# Altium project Nixie_thermometer.PrjPcb
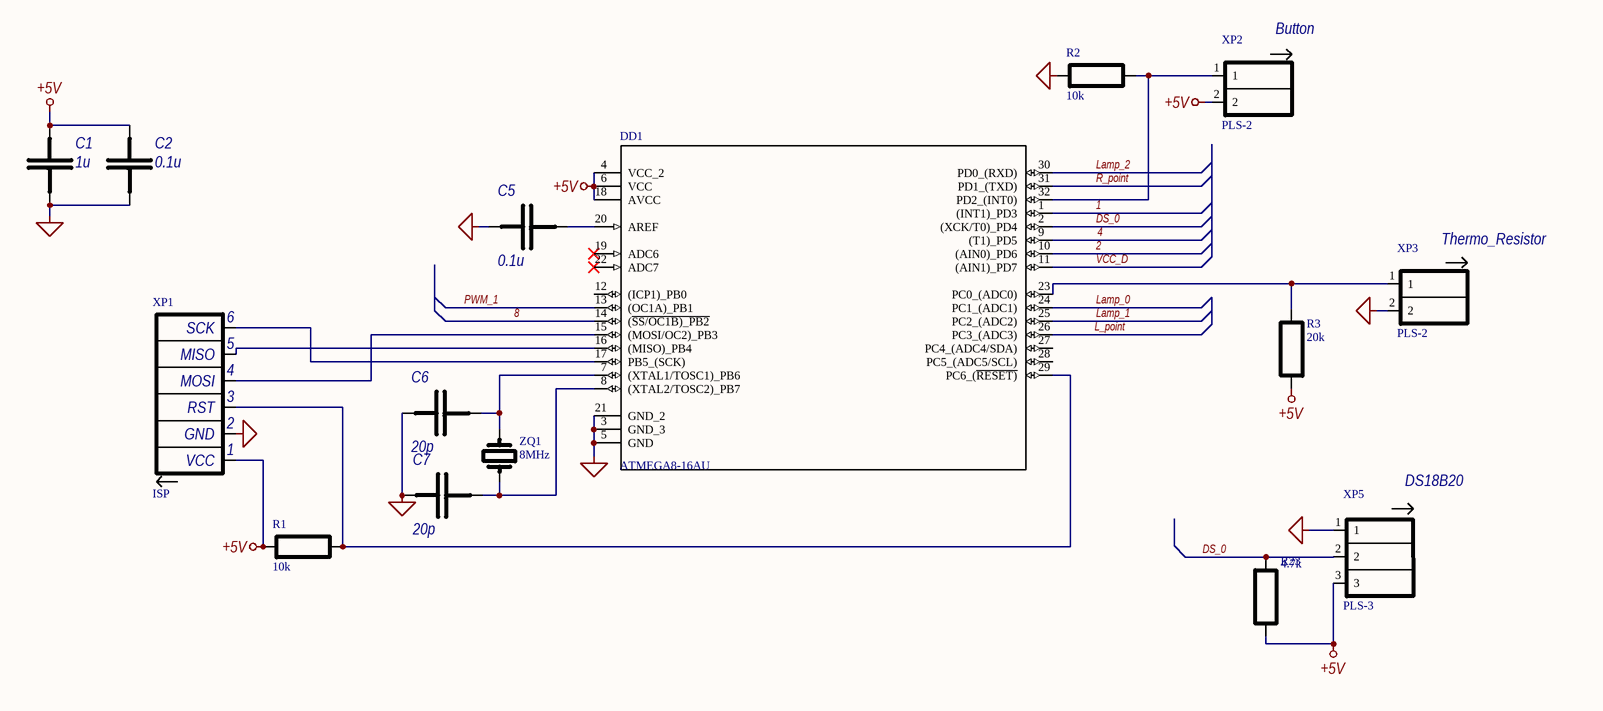
[diagram p0: mcu.SchDoc]
4 sheets, 57 parts. Net scope: global (net labels, ports and power ports of the same name join across sheets).
Board file: PCB.PcbDoc
Sheets:
  mcu.SchDoc
  Lamps.SchDoc
  Power.SchDoc
  Lamp_C_Unit.SchDoc

## Sheet mcu.SchDoc: {Наименование}
size 420 x 297 mm; ApprovedBy: {Утвердил}; CheckedBy: {Проверил}; DrawnBy: {Разработал}; Engineer: {Инженер}; DocumentNumber: {Обозначение}; SheetNumber: {}; SheetTotal: {}; Scale: {Масш.}; Title1str: {Наименование}; PageSetup: Record=PageOptions|CenterHorizontal=False|CenterVertical=False|PrintScale=0.95|XCorrection=0.00|YCorrection=0.00|PrintKind=1|BorderSize=5000000|LeftOffset=0|BottomOffset=0|Orientation=1|PaperLength=1000|PaperWidth=1000|Scale=100|PaperSource=15|PrintQuality=600|MediaType=1|DitherType=10|PaperKind=A4|PrintScaleMode=1; Title2str: {Наименование}; ProcessInspection: {Т.контр.}; Mass: {Масса}; NormInspection: {Н.контр.}; EngineerName: {Инженер}; Letter1Column: {}; Letter2Column: {}; Letter3Column: {}; DocumentType: {Документ}; DocumentType1str: {Документ}; DocumentType2str: {Документ}; ImagePath: {Перв. применение}; Rule: PcbType=ProtelPcb

### Parts
C1  1u  [CR2012-0805]
C2  0.1u  [CR2012-0805]
C5  0.1u  [CR2012-0805]
C6  20p  [CR2012-0805]
C7  20p  [CR2012-0805]
DD1  ATMEGA8-16AU  [*QFP80P900X900X120-32N]
R1  10k  [CR2012-0805]
R2  10k  [CR2012-0805]
R3  20k  [CR2012-0805]
R23  4.7k  [CR2012-0805]
XP1  ISP  [PLS-6]
XP2  PLS-2  [PLS-2]
XP3  PLS-2  [PLS-2]
XP5  PLS-3  [PLS-3]
ZQ1  8MHz  [CRYSTAL]

### Nets
+5V: C1.1 C2.1 DD1.4(VCC_2) DD1.6(VCC) DD1.18(AVCC) R1.1 R3.1 R23.2 XP1.1(VCC) XP2.2 XP5.3
SGND: C1.2 C2.2 C5.1 C6.1 C7.1 DD1.3(GND_3) DD1.5(GND) DD1.21(GND_2) R2.1 XP1.2(GND) XP3.2 XP5.1
1: DD1.1((INT1)_PD3)
2: DD1.10((AIN0)_PD6)
4: DD1.9((T1)_PD5)
8: DD1.14((~{SS/OC1B)_PB2})
DS_0: DD1.2((XCK/T0)_PD4) R23.1 XP5.2
L_point: DD1.26(PC3_(ADC3))
Lamp_0: DD1.24(PC1_(ADC1))
Lamp_1: DD1.25(PC2_(ADC2))
Lamp_2: DD1.30(PD0_(RXD))
PWM_1: DD1.13((OC1A)_PB1)
R_point: DD1.31(PD1_(TXD))
VCC_D: DD1.11((AIN1)_PD7)
NetC5_2: C5.2 DD1.20(AREF)
NetC6_2: C6.2 DD1.7((XTAL1/TOSC1)_PB6) ZQ1.1
NetC7_2: C7.2 DD1.8((XTAL2/TOSC2)_PB7) ZQ1.2
NetDD1_15: DD1.15((MOSI/OC2)_PB3) XP1.4(MOSI)
NetDD1_16: DD1.16((MISO)_PB4) XP1.5(MISO)
NetDD1_17: DD1.17(PB5_(SCK)) XP1.6(SCK)
NetDD1_23: DD1.23(PC0_(ADC0)) R3.2 XP3.1
NetDD1_29: DD1.29(PC6_(~{RESET)}) R1.2 XP1.3(RST)
NetDD1_32: DD1.32(PD2_(INT0)) R2.2 XP2.1

Not connected (* = marked no-connect by the designer): DD1 12((ICP1)_PB0) 19(ADC6)* 22(ADC7)* 27(PC4_(ADC4/SDA)) 28(PC5_(ADC5/SCL))

### Notes on the sheet
- Button
- (near XP3) Thermo_Resistor
- DS18B20
- Перв. примен.
- Справ. №
- Подп. и дата
- Инв. № дубл.
- Взам. инв. №
- Изм.
- Лист
- № докум.
- Подп.
- Дата
- Лит.
- Масса
- Масштаб
- Т.контр.
- Пров.
- Разраб.
- Листов
- Инв. № подл.
- Н.контр.
- Утв.
- Копировал
- Формат А3

### Library data of the parts
C1 = C0805-1u-X7R
C2 C5 = C0805-0.1u-X7R
C6 C7 = C0805-20p-NPO
DD1 = ATMEGA8-16AU: / AVR AVRВ® ATmega Microcontroller IC 8-Bit 16MHz 8KB _4K x 16_ FLASH 32-TQFP _7x7_ /; MF: Microchip Technology; SnapEDA_Link: https://www.snapeda.com/parts/ATMEGA8-16AU/Microchip/view-part/4246640/?ref=snap; Price: None; MP: ATMEGA8-16AU; Availability: Unavailable; Package: TQFP-32 Microchip Technology; Value: *
R1 R2 = R0805-10k-5%
R3 = R0805-20k-5%
R23 = R0805-4k7-5%
ZQ1 = Crystal_8MHz

## Sheet Lamps.SchDoc: {Наименование}
size 420 x 297 mm; ApprovedBy: {Утвердил}; CheckedBy: {Проверил}; DrawnBy: {Разработал}; Engineer: {Инженер}; DocumentNumber: {Обозначение}; SheetNumber: {}; SheetTotal: {}; Scale: {Масш.}; Title1str: {Наименование}; PageSetup: Record=PageOptions|CenterHorizontal=False|CenterVertical=False|PrintScale=0.95|XCorrection=0.00|YCorrection=0.00|PrintKind=1|BorderSize=5000000|LeftOffset=0|BottomOffset=0|Orientation=1|PaperLength=1000|PaperWidth=1000|Scale=100|PaperSource=15|PrintQuality=600|MediaType=1|DitherType=10|PaperKind=A4|PrintScaleMode=1; Title2str: {Наименование}; ProcessInspection: {Т.контр.}; Mass: {Масса}; NormInspection: {Н.контр.}; EngineerName: {Инженер}; Letter1Column: {}; Letter2Column: {}; Letter3Column: {}; DocumentType: {Документ}; DocumentType1str: {Документ}; DocumentType2str: {Документ}; ImagePath: {Перв. применение}; Rule: PcbType=ProtelPcb
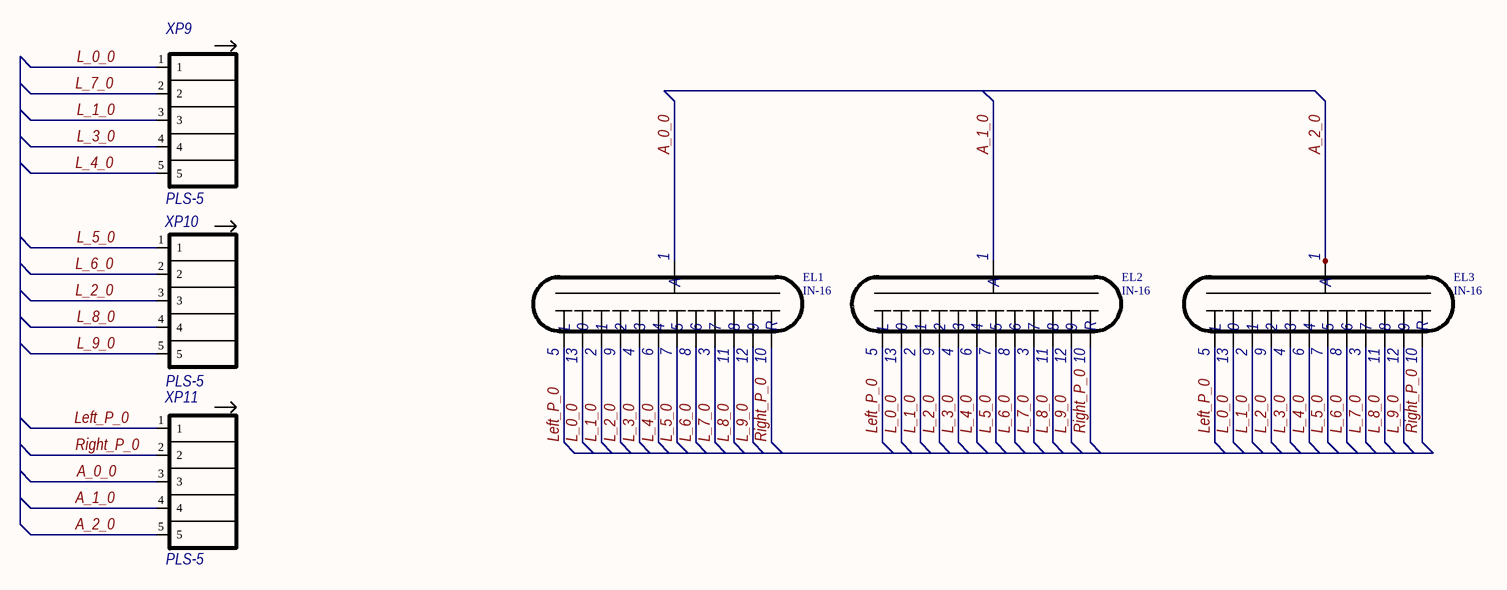
[diagram p1: Lamps.SchDoc]

### Parts
EL1  IN-16  [IN-16]
EL2  IN-16  [IN-16]
EL3  IN-16  [IN-16]
XP9  PLS-5  [PLS-5]
XP10  PLS-5  [PLS-5]
XP11  PLS-5  [PLS-5]

### Nets
A_0_0: EL1.1(A) XP11.3
A_1_0: EL2.1(A) XP11.4
A_2_0: EL3.1(A) XP11.5
L_0_0: EL1.13(0) EL2.13(0) EL3.13(0) XP9.1
L_1_0: EL1.2(1) EL2.2(1) EL3.2(1) XP9.3
L_2_0: EL1.9(2) EL2.9(2) EL3.9(2) XP10.3
L_3_0: EL1.4(3) EL2.4(3) EL3.4(3) XP9.4
L_4_0: EL1.6(4) EL2.6(4) EL3.6(4) XP9.5
L_5_0: EL1.7(5) EL2.7(5) EL3.7(5) XP10.1
L_6_0: EL1.8(6) EL2.8(6) EL3.8(6) XP10.2
L_7_0: EL1.3(7) EL2.3(7) EL3.3(7) XP9.2
L_8_0: EL1.11(8) EL2.11(8) EL3.11(8) XP10.4
L_9_0: EL1.12(9) EL2.12(9) EL3.12(9) XP10.5
Left_P_0: EL1.5(L) EL2.5(L) EL3.5(L) XP11.1
Right_P_0: EL1.10(R) EL2.10(R) EL3.10(R) XP11.2

### Notes on the sheet
- Перв. примен.
- Справ. №
- Подп. и дата
- Инв. № дубл.
- Взам. инв. №
- Изм.
- Лист
- № докум.
- Подп.
- Дата
- Лит.
- Масса
- Масштаб
- Т.контр.
- Пров.
- Разраб.
- Листов
- Инв. № подл.
- Н.контр.
- Утв.
- Копировал
- Формат А3

## Sheet Power.SchDoc: {Наименование}
size 420 x 297 mm; ApprovedBy: {Утвердил}; CheckedBy: {Проверил}; DrawnBy: {Разработал}; Engineer: {Инженер}; DocumentNumber: {Обозначение}; SheetNumber: {}; SheetTotal: {}; Scale: {Масш.}; Title1str: {Наименование}; PageSetup: Record=PageOptions|CenterHorizontal=False|CenterVertical=False|PrintScale=0.95|XCorrection=0.00|YCorrection=0.00|PrintKind=1|BorderSize=5000000|LeftOffset=0|BottomOffset=0|Orientation=1|PaperLength=1000|PaperWidth=1000|Scale=100|PaperSource=15|PrintQuality=600|MediaType=1|DitherType=10|PaperKind=A4|PrintScaleMode=1; Title2str: {Наименование}; ProcessInspection: {Т.контр.}; Mass: {Масса}; NormInspection: {Н.контр.}; EngineerName: {Инженер}; Letter1Column: {}; Letter2Column: {}; Letter3Column: {}; DocumentType: {Документ}; DocumentType1str: {Документ}; DocumentType2str: {Документ}; ImagePath: {Перв. применение}; Rule: PcbType=ProtelPcb
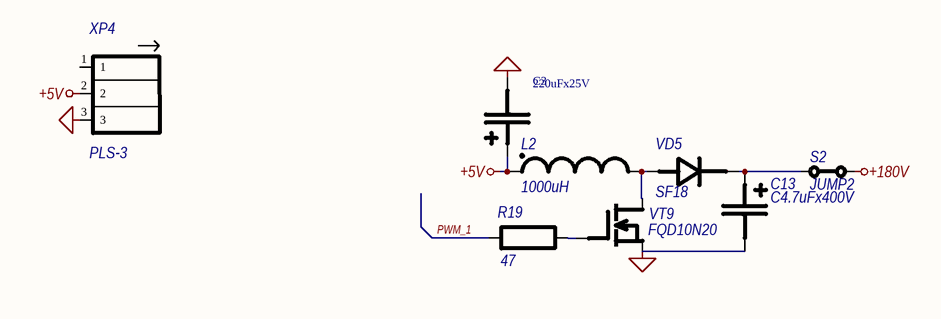
[diagram p2: Power.SchDoc]

### Parts
C3  220uFx25V  [C8x11.5]
C13  C4.7uFx400V  [C10x16]
L2  1000uH  [CHOKE1]
R19  47  [CR2012-0805]
S2  JUMP2  [JUMP]
VD5  SF18  [DO-41]
VT9  FQD10N20  [TO-252]
XP4  PLS-3  [PLS-3]

### Nets
+5V: C3.1 L2.1 XP4.2
+180V: S2.1
SGND: C3.2 C13.2 VT9.2(S) XP4.3
PWM_1: R19.1
NetC13_1: C13.1 S2.2 VD5.2(K)
NetL2_2: L2.2 VD5.1(A) VT9.3(D)
NetR19_2: R19.2 VT9.1(G)

Not connected (* = marked no-connect by the designer): XP4 1

### Notes on the sheet
- Перв. примен.
- Справ. №
- Подп. и дата
- Инв. № дубл.
- Взам. инв. №
- Изм.
- Лист
- № докум.
- Подп.
- Дата
- Лит.
- Масса
- Масштаб
- Т.контр.
- Пров.
- Разраб.
- Листов
- Инв. № подл.
- Н.контр.
- Утв.
- Копировал
- Формат А3

### Library data of the parts
C3 = C220uFx25V YAGEO SY: SY025M0220A3F-0811
L2 = CHOKE_1
R19 = R0805-47R-5%

## Sheet Lamp_C_Unit.SchDoc: {Наименование}
size 420 x 297 mm; ApprovedBy: {Утвердил}; CheckedBy: {Проверил}; DrawnBy: {Разработал}; Engineer: {Инженер}; DocumentNumber: {Обозначение}; SheetNumber: {}; SheetTotal: {}; Scale: {Масш.}; Title1str: {Наименование}; PageSetup: Record=PageOptions|CenterHorizontal=False|CenterVertical=False|PrintScale=0.95|XCorrection=0.00|YCorrection=0.00|PrintKind=1|BorderSize=5000000|LeftOffset=0|BottomOffset=0|Orientation=1|PaperLength=1000|PaperWidth=1000|Scale=100|PaperSource=15|PrintQuality=600|MediaType=1|DitherType=10|PaperKind=A4|PrintScaleMode=1; Title2str: {Наименование}; ProcessInspection: {Т.контр.}; Mass: {Масса}; NormInspection: {Н.контр.}; EngineerName: {Инженер}; Letter1Column: {}; Letter2Column: {}; Letter3Column: {}; DocumentType: {Документ}; DocumentType1str: {Документ}; DocumentType2str: {Документ}; ImagePath: {Перв. применение}; Rule: PcbType=ProtelPcb
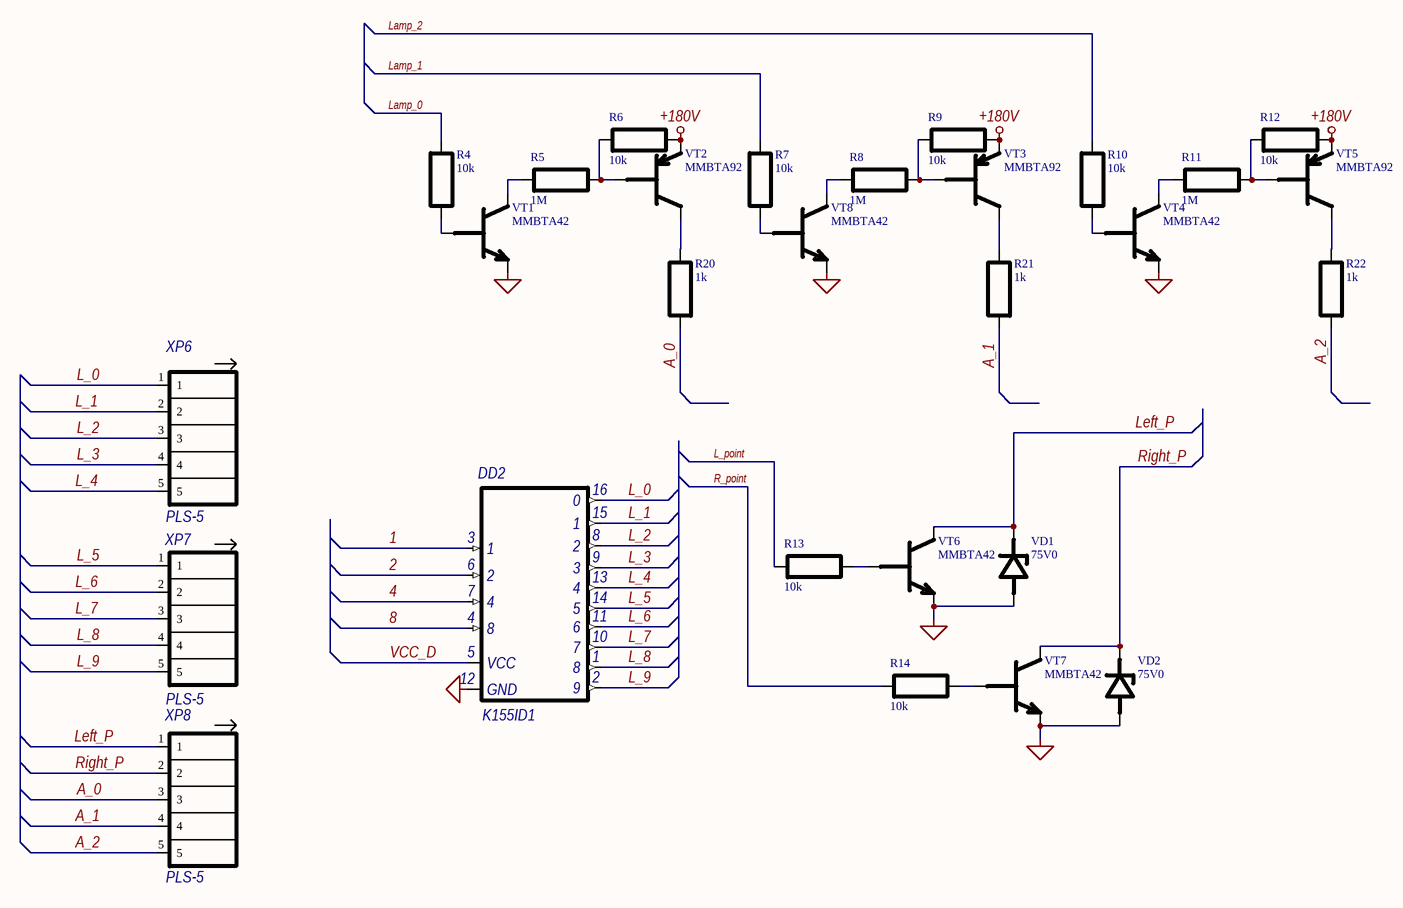
[diagram p3: Lamp_C_Unit.SchDoc]

### Parts
DD2  K155ID1  [DIP16]
R4  10k  [CR2012-0805]
R5  1M  [CR2012-0805]
R6  10k  [CR2012-0805]
R7  10k  [CR2012-0805]
R8  1M  [CR2012-0805]
R9  10k  [CR2012-0805]
R10  10k  [CR2012-0805]
R11  1M  [CR2012-0805]
R12  10k  [CR2012-0805]
R13  10k  [CR2012-0805]
R14  10k  [CR2012-0805]
R20  1k  [CR2012-0805]
R21  1k  [CR2012-0805]
R22  1k  [CR2012-0805]
VD1  75V0  [SOD-80]
VD2  75V0  [SOD-80]
VT1  MMBTA42  [SOT-23]
VT2  MMBTA92  [SOT-23]
VT3  MMBTA92  [SOT-23]
VT4  MMBTA42  [SOT-23]
VT5  MMBTA92  [SOT-23]
VT6  MMBTA42  [SOT-23]
VT7  MMBTA42  [SOT-23]
VT8  MMBTA42  [SOT-23]
XP6  PLS-5  [PLS-5]
XP7  PLS-5  [PLS-5]
XP8  PLS-5  [PLS-5]

### Nets
+180V: R6.2 R9.2 R12.2 VT2.2(E) VT3.2(E) VT5.2(E)
SGND: DD2.12(GND) VD1.1(A) VD2.1(A) VT1.2(E) VT4.2(E) VT6.2(E) VT7.2(E) VT8.2(E)
1: DD2.3(1)
2: DD2.6(2)
4: DD2.7(4)
8: DD2.4(8)
A_0: R20.1 XP8.3
A_1: R21.1 XP8.4
A_2: R22.1 XP8.5
L_0: DD2.16(0) XP6.1
L_1: DD2.15(1) XP6.2
L_2: DD2.8(2) XP6.3
L_3: DD2.9(3) XP6.4
L_4: DD2.13(4) XP6.5
L_5: DD2.14(5) XP7.1
L_6: DD2.11(6) XP7.2
L_7: DD2.10(7) XP7.3
L_8: DD2.1(8) XP7.4
L_9: DD2.2(9) XP7.5
L_point: R13.1
Lamp_0: R4.1
Lamp_1: R7.1
Lamp_2: R10.1
Left_P: VD1.2(K) VT6.3(C) XP8.1
R_point: R14.1
Right_P: VD2.2(K) VT7.3(C) XP8.2
VCC_D: DD2.5(VCC)
NetR4_2: R4.2 VT1.1(B)
NetR5_1: R5.1 VT1.3(C)
NetR5_2: R5.2 R6.1 VT2.1(B)
NetR7_2: R7.2 VT8.1(B)
NetR8_1: R8.1 VT8.3(C)
NetR8_2: R8.2 R9.1 VT3.1(B)
NetR10_2: R10.2 VT4.1(B)
NetR11_1: R11.1 VT4.3(C)
NetR11_2: R11.2 R12.1 VT5.1(B)
NetR13_2: R13.2 VT6.1(B)
NetR14_2: R14.2 VT7.1(B)
NetR20_2: R20.2 VT2.3(C)
NetR21_2: R21.2 VT3.3(C)
NetR22_2: R22.2 VT5.3(C)

### Notes on the sheet
- Перв. примен.
- Справ. №
- Подп. и дата
- Инв. № дубл.
- Взам. инв. №
- Изм.
- Лист
- № докум.
- Подп.
- Дата
- Лит.
- Масса
- Масштаб
- Т.контр.
- Пров.
- Разраб.
- Листов
- Инв. № подл.
- Н.контр.
- Утв.
- Копировал
- Формат А3

### Library data of the parts
R4-R14 = R0805-10k-5%
R20-R22 = R0805-1k-5%
VD1 VD2 = BZV55-C20V0

## Nets that join several sheets
+5V: mcu (11 pins), Power (C3.1 L2.1 XP4.2)
+180V: Power (S2.1), Lamp_C_Unit (6 pins)
SGND: mcu (12 pins), Power (C3.2 C13.2 VT9.2 XP4.3), Lamp_C_Unit (8 pins)
1: mcu (DD1.1), Lamp_C_Unit (DD2.3)
2: mcu (DD1.10), Lamp_C_Unit (DD2.6)
4: mcu (DD1.9), Lamp_C_Unit (DD2.7)
8: mcu (DD1.14), Lamp_C_Unit (DD2.4)
L_point: mcu (DD1.26), Lamp_C_Unit (R13.1)
Lamp_0: mcu (DD1.24), Lamp_C_Unit (R4.1)
Lamp_1: mcu (DD1.25), Lamp_C_Unit (R7.1)
Lamp_2: mcu (DD1.30), Lamp_C_Unit (R10.1)
PWM_1: mcu (DD1.13), Power (R19.1)
R_point: mcu (DD1.31), Lamp_C_Unit (R14.1)
VCC_D: mcu (DD1.11), Lamp_C_Unit (DD2.5)